# Altium schematic sheet radio.SchDoc: Radio module
size A4; Organization: GPA & FRYK Industries; DocumentNumber: 4; Revision: REV 0; SheetNumber: 4; SheetTotal: 6
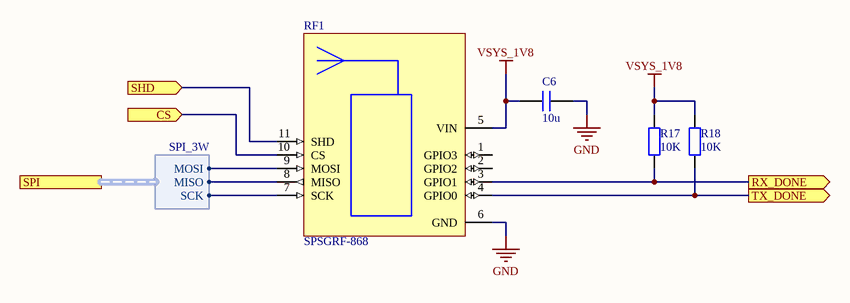
[diagram p0: radio.SchDoc]

## Parts
C6  value 10u  [CAPC3216X14N]  (hidden comment: cap)
R17  value 10K  [RESC1005X04N]  (hidden comment: res)
R18  value 10K  [RESC1005X04N]  (hidden comment: res)
RF1  SPSGRF-868  [spsgrf]

## Ports
CS (in), RX_DONE (out), SHD (in), SPI (harness SPI_3W), TX_DONE (out)

## Harnesses
SPI_3W: MOSI, MISO, SCK

## Nets
GND: C6.2 RF1.6(GND)
VSYS_1V8: C6.1 R17.2 R18.2 RF1.5(VIN)
CS: RF1.10(CS) ; port CS
RX_DONE: R17.1 RF1.3(GPIO1) ; port RX_DONE
SHD: RF1.11(SHD) ; port SHD
TX_DONE: R18.1 RF1.4(GPIO0) ; port TX_DONE
NetRF1_7: RF1.7(SCK) ; port SPI.SCK
NetRF1_8: RF1.8(MISO) ; port SPI.MISO
NetRF1_9: RF1.9(MOSI) ; port SPI.MOSI

Not connected (* = marked no-connect by the designer): RF1 1(GPIO3) 2(GPIO2)

## Notes on the sheet
- Title
- Size:
- Date:
- A4
- Number:
- Time:
- Revision:
- Sheet
- of
- Repository:

## Library data of the parts
C6 = cap: Capacitor; type: X5R; voltage: *; #digikey: *; #mouser: *; Supplier 1: Mouser; Supplier Part Number 1: 810-C3216X5R1C106M
R17 R18 = res: Resistor; power: *; voltage: *; #digikey: *; #mouser: *
RF1 = spsgrf-868: Sub-GHz (868 or 915 MHz) low power programmable RF / transceiver modules; ComponentLink1Description: datasheet; ComponentLink1URL: https://www.mouser.se/datasheet/2/389/spsgrf-955290.pdf